# EAGLE design big7segment (EAGLE 6.5.0)
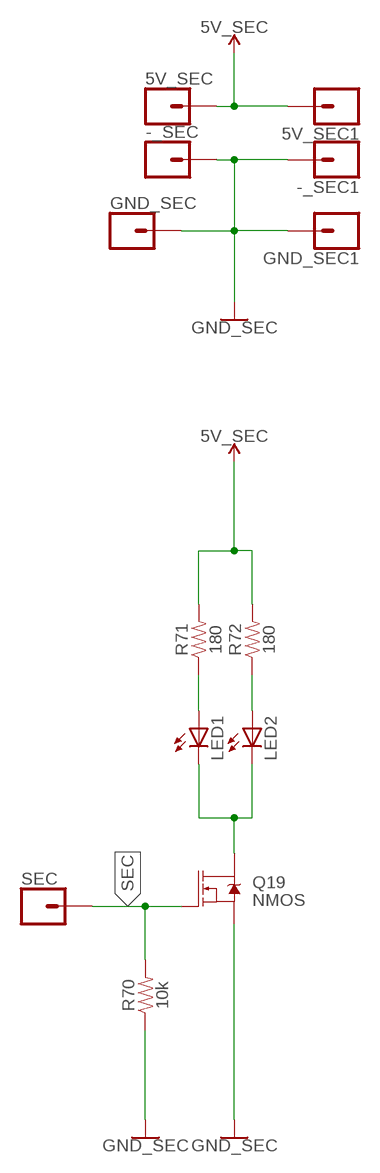
[diagram p0: schematic, sheet 1]

## Parts
5V_SEC  CONN_01OFFSET  [1X01_OFFSET]
5V_SEC1  CONN_01OFFSET  [1X01_OFFSET]
-_SEC  CONN_01OFFSET  [1X01_OFFSET]
-_SEC1  CONN_01OFFSET  [1X01_OFFSET]
GND_SEC  CONN_01OFFSET  [1X01_OFFSET]
GND_SEC1  CONN_01OFFSET  [1X01_OFFSET]
LED1  LED5MM  [LED5MM]
LED2  LED5MM  [LED5MM]
Q19  NMOS  MOSFET-NCH-AO3404A  [SOT23-3]
R70  10k  0.3OHM-0805-1/8W-1%  [0805]
R71  180  0.3OHM-0805-1/8W-1%  [0805]
R72  180  0.3OHM-0805-1/8W-1%  [0805]
SEC  CONN_01OFFSET  [1X01_OFFSET]

## Nets
GND_SEC: -_SEC1.1 -_SEC.1 GND_SEC1.1 GND_SEC.1 Q19.2(S) R70.1
N$70: LED2.A R72.1
N$71: LED1.A R71.1
N$75: LED1.K(C) LED2.K(C) Q19.3(D)
SEC: Q19.1(G) R70.2 SEC.1
VCC_1: 5V_SEC1.1 5V_SEC.1 R71.2 R72.2 ; supply symbol labelled 5V_SEC

## Library data of the parts
5V_SEC 5V_SEC1 -_SEC -_SEC1 GND_SEC GND_SEC1 SEC = SparkFun-Connectors:CONN_01: Single connection point. Often used as Generic Header-pin footprint for 0.1 inch spaced/style header connections On any of the 0.1 inch spaced packages, you can populate with these: Break Away Headers - Straight <https://www.sparkfun.com/products/116> (PRT-00116) Break Away Male Headers - Right Angle <https://www.sparkfun.com/products/553> (PRT-00553) Female Headers <https://www.sparkfun.com/products/115> (PRT-00115) Break Away Headers - Machine Pin <https://www.sparkfun.com/products/117> (PRT-00117) Break Away Female Headers - Swiss Machine Pin <https://www.sparkfun.com/products/743> (PRT-00743) This device is also useful as a general connection point to wire up your design to another part of your project. Our various solder wires solder well into these plated through hole pads. Hook-Up Wire - Assortment (Stranded, 22 AWG) <https://www.sparkfun.com/products/11375> (PRT-11375) Hook-Up Wire - Assortment (Solid Core, 22 AWG) <https://www.sparkfun.com/products/11367> (PRT-11367) View the entire wire category on our website here <https://www.sparkfun.com/categories/141> Special notes: SMTSO-256-ET is a "flush mount" nut for a 4-40 screw. We mostly use this on specialty testbeds; it is a nice way to connect hardware to your PCB at an adjustable hieght. Also note, the SNAP packages are for using a snappable style connector. We sell a baggie of snaps and they are also used on two LilyPad designs: Snap Assortment - 30 pack (male and female) <https://www.sparkfun.com/products/11347> (DEV-11347) LilyPad Arduino SimpleSnap <https://www.sparkfun.com/products/10941> (DEV-10941) LilyPad SimpleSnap Protoboard <https://www.sparkfun.com/products/10940> (DEV-10940)
LED1 LED2 = led:LED: LED OSRAM: - CHIPLED LG R971, LG N971, LY N971, LG Q971, LY Q971, LO R971, LY R971 LH N974, LH R974 LS Q976, LO Q976, LY Q976 LO Q996 - Hyper CHIPLED LW Q18S LB Q993, LB Q99A, LB R99A - SideLED LS A670, LO A670, LY A670, LG A670, LP A670 LB A673, LV A673, LT A673, LW A673 LH A674 LY A675 LS A676, LA A676, LO A676, LY A676, LW A676 LS A679, LY A679, LG A679 - Hyper Micro SIDELED® LS Y876, LA Y876, LO Y876, LY Y876 LT Y87S - SmartLED LW L88C, LW L88S LB L89C, LB L89S, LG L890 LS L89K, LO L89K, LY L89K LS L896, LA L896, LO L896, LY L896 - TOPLED LS T670, LO T670, LY T670, LG T670, LP T670 LSG T670, LSP T670, LSY T670, LOP T670, LYG T670 LG T671, LOG T671, LSG T671 LB T673, LV T673, LT T673, LW T673 LH T674 LS T676, LA T676, LO T676, LY T676, LB T676, LH T676, LSB T676, LW T676 LB T67C, LV T67C, LT T67C, LS T67K, LO T67K, LY T67K, LW E67C LS E67B, LA E67B, LO E67B, LY E67B, LB E67C, LV E67C, LT E67C LW T67C LS T679, LY T679, LG T679 LS T770, LO T770, LY T770, LG T770, LP T770 LB T773, LV T773, LT T773, LW T773 LH T774 LS E675, LA E675, LY E675, LS T675 LS T776, LA T776, LO T776, LY T776, LB T776 LHGB T686 LT T68C, LB T68C - Hyper Mini TOPLED® LB M676 - Mini TOPLED Santana® LG M470 LS M47K, LO M47K, LY M47K Source: http://www.osram.convergy.de LUXEON: - LUMILED® LXK2-PW12-R00, LXK2-PW12-S00, LXK2-PW14-U00, LXK2-PW14-V00 LXK2-PM12-R00, LXK2-PM12-S00, LXK2-PM14-U00 LXK2-PE12-Q00, LXK2-PE12-R00, LXK2-PE12-S00, LXK2-PE14-T00, LXK2-PE14-U00 LXK2-PB12-K00, LXK2-PB12-L00, LXK2-PB12-M00, LXK2-PB14-N00, LXK2-PB14-P00, LXK2-PB14-Q00 LXK2-PR12-L00, LXK2-PR12-M00, LXK2-PR14-Q00, LXK2-PR14-R00 LXK2-PD12-Q00, LXK2-PD12-R00, LXK2-PD12-S00 LXK2-PH12-R00, LXK2-PH12-S00 LXK2-PL12-P00, LXK2-PL12-Q00, LXK2-PL12-R00 Source: www.luxeon.com KINGBRIGHT: KA-3528ASYC Source: www.kingbright.com
Q19 = SparkFun-DiscreteSemi:MOSFET-NCH: N-channel MOSFETs Voltage controlled devices that allow control of high current outputs. SparkFun Products: SparkFun OpenScale <https://www.sparkfun.com/products/13261> SparkFun Digital Sandbox <https://www.sparkfun.com/products/12651> SparkFun Monster Moto Shield <https://www.sparkfun.com/products/10182> SparkFun MOSFET Power Controller <https://www.sparkfun.com/products/11214>; PROD_ID: TRANS-12988; VALUE: 5.8A/30V/35mΩ
R70-R72 = SparkFun-Resistors:0.3OHM: 0.3Ω resistor A resistor is a passive two-terminal electrical component that implements electrical resistance as a circuit element. Resistors act to reduce current flow, and, at the same time, act to lower voltage levels within circuits. - Wikipedia; PROD_ID: RES-11622; VALUE: 0.3

## Board
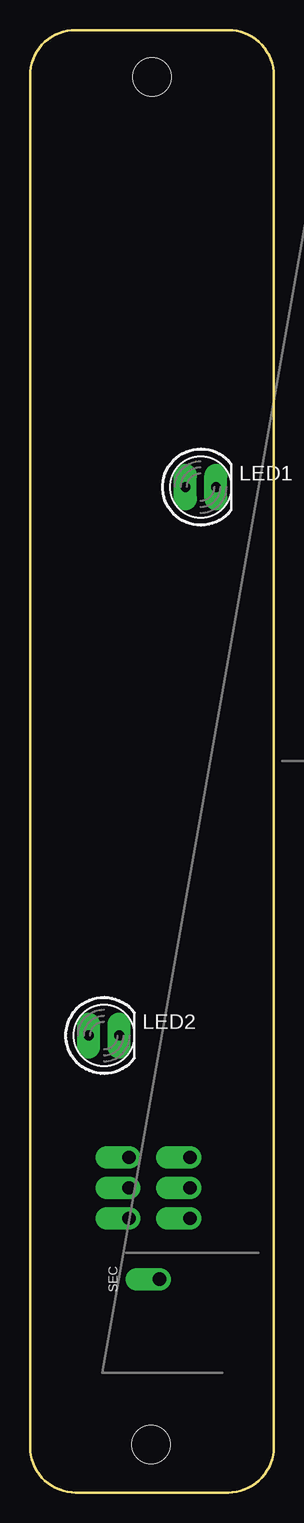
[diagram p1: board, top side]
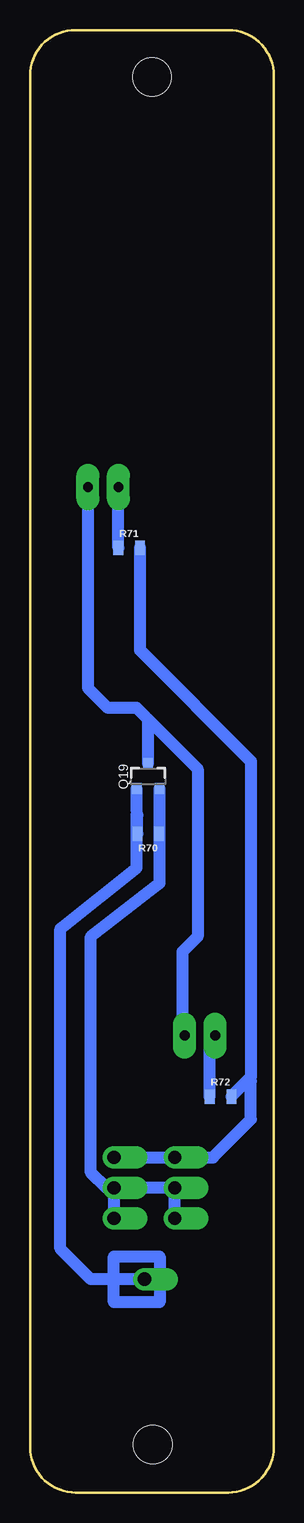
[diagram p2: board, bottom side, seen from below]

Size 20.32 x 121.92 mm. Coordinates in mm from the lower left corner, seen from the top.
Outline: 16.51,121.92 3.81,121.92 arc90 0,118.11 0,3.81 arc90 3.81,0 16.51,0 arc90 20.32,3.81 20.32,118.11 arc90 16.51,121.92
Copper layers (1*16): Top 0.035mm / dielectric 1.5mm / Bottom 0.035mm
Design rules "SeeedStudio_2layer_DRU_no_angle_20140221 *": minimum track width 6mil, minimum drill 12mil, track to track 6mil, track to pad 6mil, pad to pad 6mil, via to via 6mil, smd to smd 0mil, copper to edge 10mil, drill to drill 10mil, minimum pad ring 10mil, minimum via ring 6mil, stop-mask expansion 2mil, vias tented up to drill 20mil, thermal gap 8mil
Holes 3.2 mm at 10.15,118 10.1,4

### Footprints (pad centres in the part's own frame; a part is rotated, then mirrored left to right if it is on the bottom)
1X01_OFFSET = drill 1.118 pad 1.88 offset: 1 0,0
LED5MM = drill 0.813 pad 1.93 long: A -1.27,0; K 1.27,0
SOT23-3 = smd 0.8 x 0.9: 1 -0.95,-1; 2 0.95,-1; 3 0,1.1
0805 = smd 0.8 x 1.2: 1 -0.9,0; 2 0.9,0

### Placement (x,y rotation side)
5V_SEC  13.34,27.94 90 top
5V_SEC1  8.26,27.94 90 top
-_SEC  13.34,25.4 90 top
-_SEC1  8.26,25.4 90 top
GND_SEC  13.34,22.86 90 top
GND_SEC1  8.26,22.86 90 top
LED1  14.22,83.82 0 top
LED2  6.16,38.1 0 top
Q19  10.48,59.69 0 bottom
R70  10.47,54.91 180 bottom
R71  12.06,78.74 0 bottom
R72  4.45,33.02 0 bottom
SEC  10.79,17.78 90 top

### Tracks (layer width: path | path; a pad name or v marks a point on that pad's centre or on a via)
GND_SEC
  Bottom 0.406: R70.1 9.57,56.47 9.53,56.52
  Bottom 0.813: -_SEC1.1 -_SEC.1 | Q19.2
  Bottom 1.016: -_SEC.1 GND_SEC.1 | GND_SEC1.1 -_SEC1.1 13.97,25.4 15.24,26.67 15.24,46.35 9.53,50.8 9.53,56.52 Q19.2
N$70
  Bottom 0.813: 5.34,37.65 LED2.A
  Bottom 1.016: R72.1 5.34,37.65
N$71
  Bottom 0.406: 12.96,83.81 LED1.A
  Bottom 1.016: R71.1 12.96,83.81
N$75
  Bottom 0.406: 10.48,64.45 10.79,64.77
  Bottom 0.813: 7.62,38.29 LED2.K
  Bottom 1.016: LED1.K 15.49,67.08 13.82,65.41 11.43,65.41 10.79,64.77 | 7.62,38.29 7.62,45.09 6.35,46.35 6.35,60.33 8.09,62.06 10.48,64.45 Q19.3
SEC
  Bottom 0.406: 11.43,56.88 | 11.38,56.46 11.43,56.52
  Bottom 0.813: 11.43,56.52 11.43,56.88
  Bottom 1.016: SEC.1 13.34,17.78 | 13.34,17.78 13.34,19.68 9.53,19.68 9.53,15.88 13.34,15.88 13.34,17.78 | 13.34,17.78 15.24,17.78 17.78,20.32 17.78,46.99 11.43,52.07 11.43,56.52 | R70.2 11.38,56.46 | 11.43,56.88 Q19.1
VCC_1
  Bottom 0.813: 1.91,34.66 2.09,34.48 1.91,34.29
  Bottom 1.016: R71.2 11.16,70.22 1.91,60.96 1.91,34.66 | 2.09,34.48 R72.2 | 1.91,34.29 1.91,31.11 5.08,27.94 5V_SEC1.1 5V_SEC.1